# EAGLE schematic PLD Controller Board (EAGLE 9.6.2)
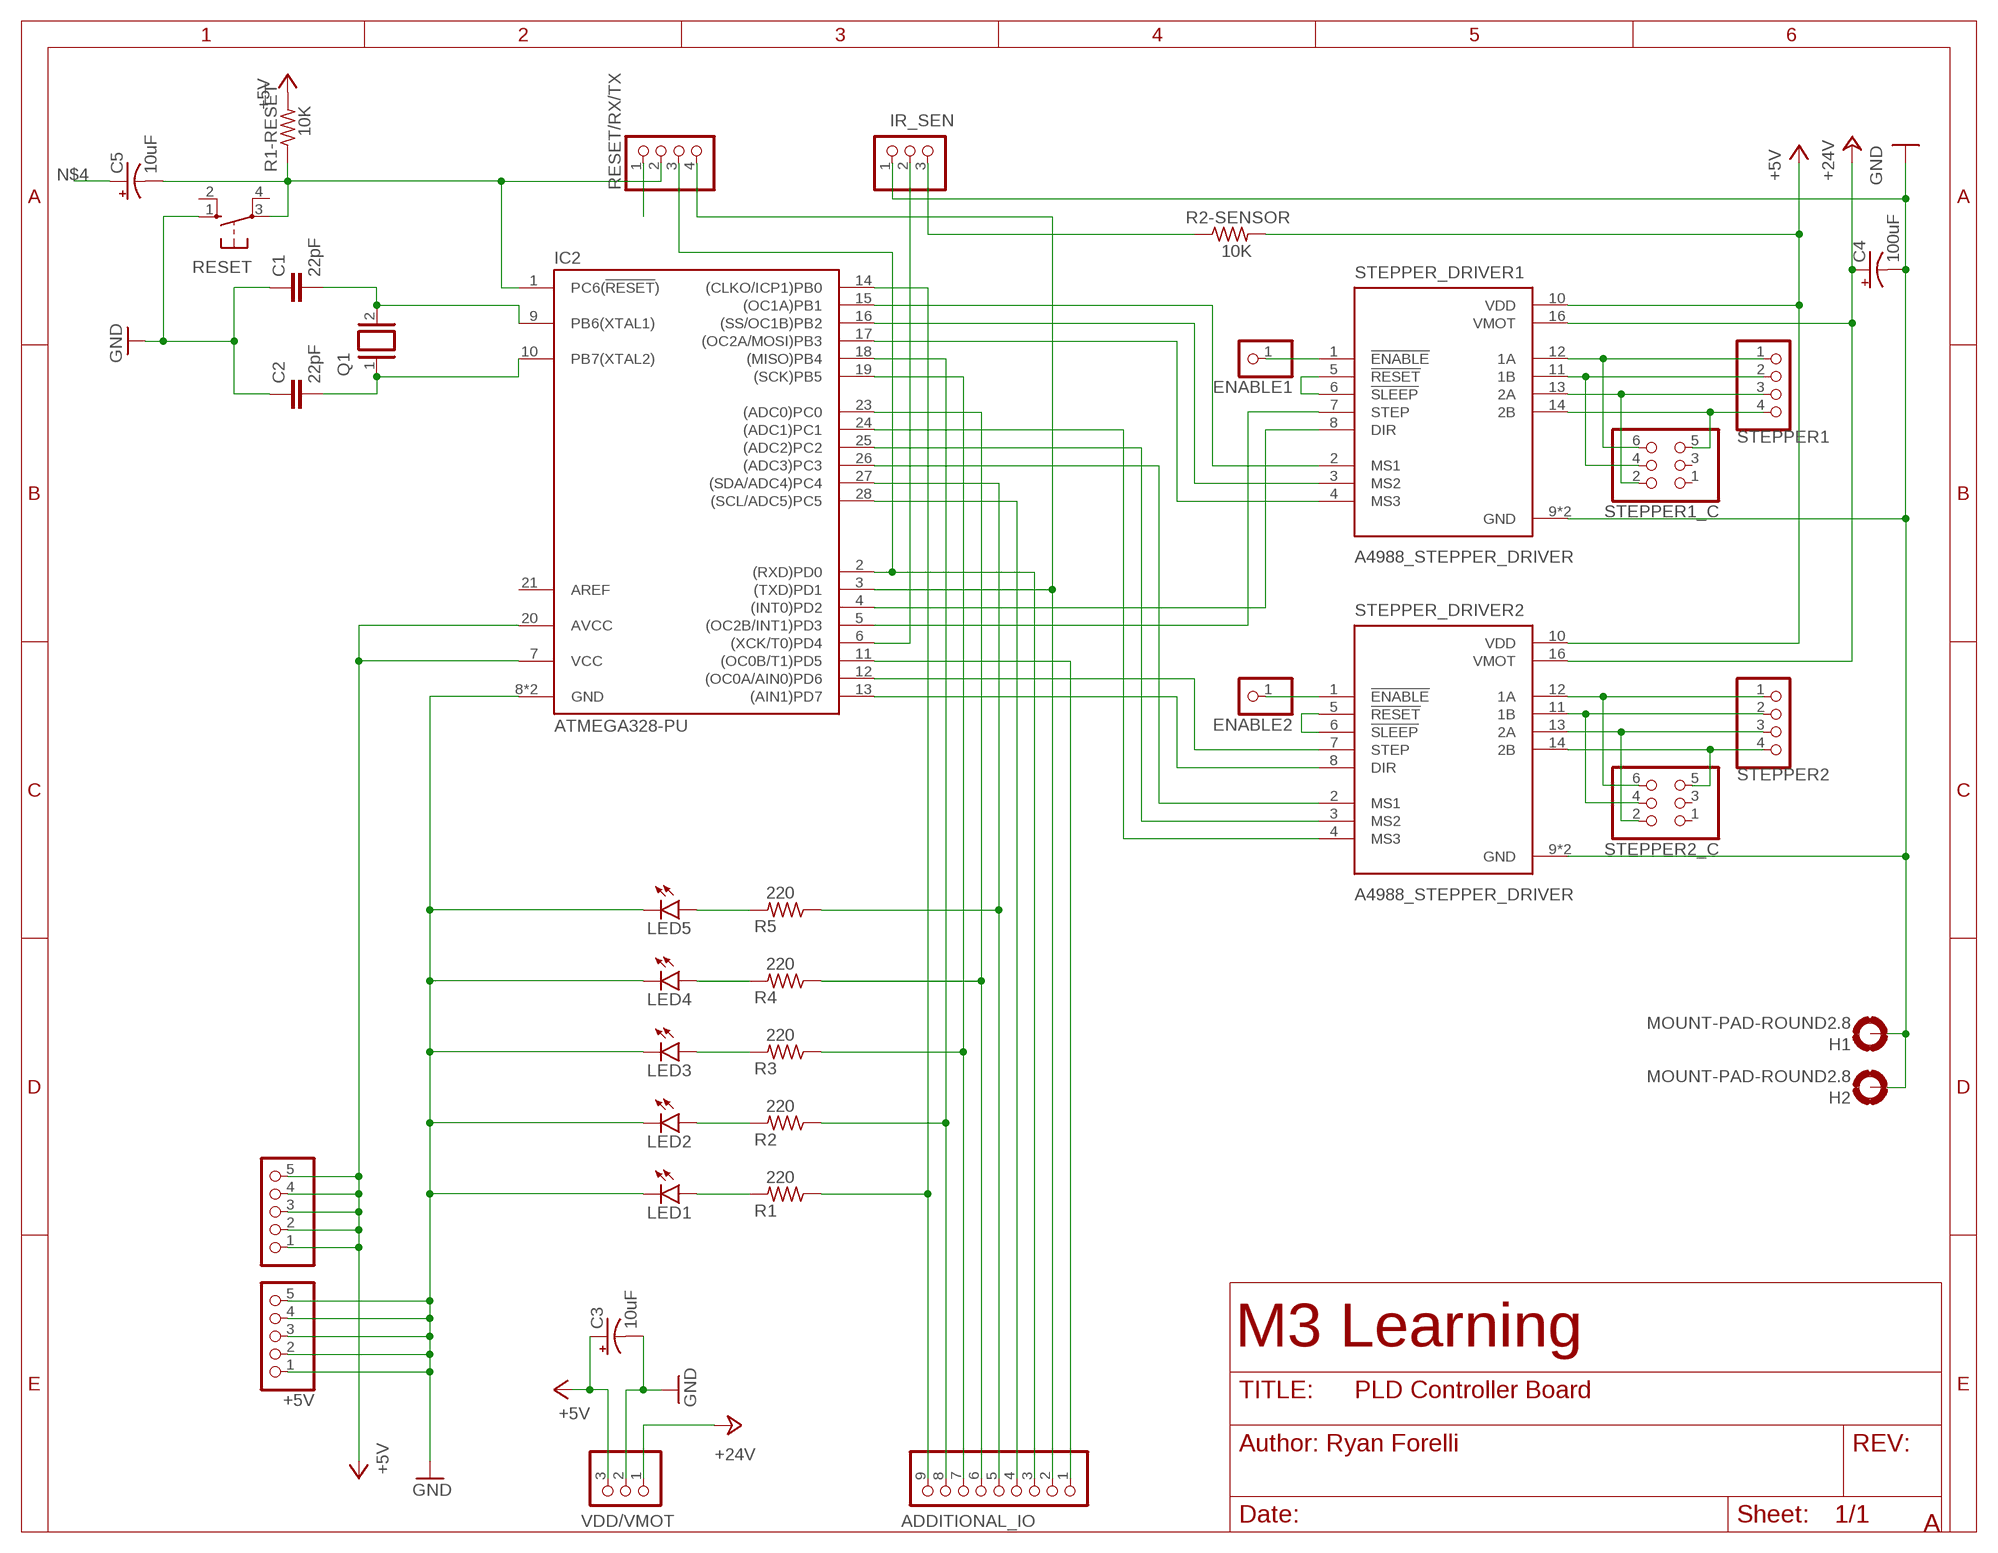
[diagram p0: schematic, sheet 1]

## Parts
+5V  PINHD-1X5  [1X05]
ADDITIONAL_IO  PINHD-1X9  [1X09]
C1  22pF  22PF-PTH-2.54MM-200V-5%  [CAP-PTH-2.54]
C2  22pF  22PF-PTH-2.54MM-200V-5%  [CAP-PTH-2.54]
C3  10uF  10UF-POLAR-RADIAL-2.5MM-25V-20%  [CPOL-RADIAL-2.5MM-5MM]
C4  100uF  10UF-POLAR-RADIAL-2.5MM-25V-20%  [CPOL-RADIAL-2.5MM-5MM]
C5  10uF  10UF-POLAR-RADIAL-2.5MM-25V-20%  [CPOL-RADIAL-2.5MM-5MM]
ENABLE1  PINHD-1X1  [1X01]
ENABLE2  PINHD-1X1  [1X01]
GND  PINHD-1X5  [1X05]
H1  MOUNT-PAD-ROUND2.8  [2,8-PAD]
H2  MOUNT-PAD-ROUND2.8  [2,8-PAD]
IC2  ATMEGA328-PU  [DIL28]
IR_SEN  PINHD-1X3  [1X03]
LED1  LED5MM  [LED5MM]
LED2  LED5MM  [LED5MM]
LED3  LED5MM  [LED5MM]
LED4  LED5MM  [LED5MM]
LED5  LED5MM  [LED5MM]
Q1  XTAL/S  [QS]
R1  220  R-US_0204/7  [0204/7]
R1-RESET  10K  R-US_0204/7  [0204/7]
R2  220  R-US_0204/7  [0204/7]
R2-SENSOR  10K  R-US_0204/7  [0204/7]
R3  220  R-US_0204/7  [0204/7]
R4  220  R-US_0204/7  [0204/7]
R5  220  R-US_0204/7  [0204/7]
RESET  10-XX  [B3F-10XX]
RESET/RX/TX  PINHD-1X4  [1X04]
STEPPER1  PINHD-1X4  [1X04]
STEPPER1_C  PINHD-2X3  [2X03]
STEPPER2  PINHD-1X4  [1X04]
STEPPER2_C  PINHD-2X3  [2X03]
STEPPER_DRIVER1  A4988_STEPPER_DRIVER  A4988_STEPPER_MOTOR_DRIVER_CARRIER  [MODULE_A4988_STEPPER_MOTOR_DRIVER_CARRIER]
STEPPER_DRIVER2  A4988_STEPPER_DRIVER  A4988_STEPPER_MOTOR_DRIVER_CARRIER  [MODULE_A4988_STEPPER_MOTOR_DRIVER_CARRIER]
VDD/VMOT  PINHD-1X3  [1X03]

## Nets
+5V: C3.1(+) GND.1 GND.2 GND.3 GND.4 GND.5 IC2.7(VCC) IC2.20(AVCC) R1-RESET.2 R2-SENSOR.2 STEPPER_DRIVER1.10(VDD) STEPPER_DRIVER2.10(VDD) VDD/VMOT.3
+24V: C4.1(+) STEPPER_DRIVER1.16(VMOT) STEPPER_DRIVER2.16(VMOT) VDD/VMOT.1
GND: +5V.1 +5V.2 +5V.3 +5V.4 +5V.5 C1.1 C2.1 C3.2(-) C4.2(-) H1.B2,8(MOUNT) H2.B2,8(MOUNT) IC2.8(GND) IC2.22(GND) IR_SEN.1 LED1.K(C) LED2.K(C) LED3.K(C) LED4.K(C) LED5.K(C) RESET.1(S) STEPPER_DRIVER1.9(GND) STEPPER_DRIVER1.15(GND) STEPPER_DRIVER2.9(GND) STEPPER_DRIVER2.15(GND) VDD/VMOT.2
N$1: C5.2(-) IC2.1(PC6(!RESET!)) R1-RESET.1 RESET.3(P) RESET/RX/TX.2
N$2: C1.2 IC2.9(PB6(XTAL1)) Q1.2
N$3: C2.2 IC2.10(PB7(XTAL2)) Q1.1
N$4: C5.1(+) RESET/RX/TX.1
N$5: STEPPER_DRIVER1.5(!RESET) STEPPER_DRIVER1.6(!SLEEP)
N$6: STEPPER_DRIVER2.5(!RESET) STEPPER_DRIVER2.6(!SLEEP)
N$7: IR_SEN.3 R2-SENSOR.1
N$8: STEPPER1.2 STEPPER1_C.4 STEPPER_DRIVER1.11(1B)
N$9: STEPPER1.3 STEPPER1_C.2 STEPPER_DRIVER1.13(2A)
N$10: STEPPER1.4 STEPPER1_C.5 STEPPER_DRIVER1.14(2B)
N$11: STEPPER2.1 STEPPER2_C.6 STEPPER_DRIVER2.12(1A)
N$12: STEPPER2.2 STEPPER2_C.4 STEPPER_DRIVER2.11(1B)
N$13: STEPPER2.3 STEPPER2_C.2 STEPPER_DRIVER2.13(2A)
N$14: STEPPER2.4 STEPPER2_C.5 STEPPER_DRIVER2.14(2B)
N$15: ENABLE1.1 STEPPER_DRIVER1.1(!ENABLE)
N$16: ENABLE2.1 STEPPER_DRIVER2.1(!ENABLE)
N$17: LED4.A R4.2
N$18: LED3.A R3.2
N$19: LED2.A R2.2
N$20: LED1.A R1.2
N$21: IC2.4((INT0)PD2) STEPPER_DRIVER1.8(DIR)
N$22: IC2.5((OC2B/INT1)PD3) STEPPER_DRIVER1.7(STEP)
N$23: IC2.13((AIN1)PD7) STEPPER_DRIVER2.8(DIR)
N$24: IC2.12((OC0A/AIN0)PD6) STEPPER_DRIVER2.7(STEP)
N$25: IC2.15((OC1A)PB1) STEPPER_DRIVER1.2(MS1)
N$26: IC2.16((SS/OC1B)PB2) STEPPER_DRIVER1.3(MS2)
N$27: IC2.17((OC2A/MOSI)PB3) STEPPER_DRIVER1.4(MS3)
N$28: IC2.26((ADC3)PC3) STEPPER_DRIVER2.2(MS1)
N$29: IC2.25((ADC2)PC2) STEPPER_DRIVER2.3(MS2)
N$30: IC2.24((ADC1)PC1) STEPPER_DRIVER2.4(MS3)
N$31: IC2.6((XCK/T0)PD4) IR_SEN.2
N$32: ADDITIONAL_IO.9 IC2.14((CLKO/ICP1)PB0) R1.1
N$33: ADDITIONAL_IO.8 IC2.18((MISO)PB4) R2.1
N$34: ADDITIONAL_IO.7 IC2.19((SCK)PB5) R3.1
N$35: ADDITIONAL_IO.6 IC2.23((ADC0)PC0) R4.1
N$36: ADDITIONAL_IO.5 IC2.27((SDA/ADC4)PC4) R5.1
N$37: ADDITIONAL_IO.4 IC2.28((SCL/ADC5)PC5)
N$38: ADDITIONAL_IO.3 IC2.2((RXD)PD0) RESET/RX/TX.3
N$39: ADDITIONAL_IO.2 IC2.3((TXD)PD1) RESET/RX/TX.4
N$40: ADDITIONAL_IO.1 IC2.11((OC0B/T1)PD5)
N$41: LED5.A R5.2
N$42: STEPPER1.1 STEPPER1_C.6 STEPPER_DRIVER1.12(1A)
Unconnected: IC2.21(AREF) RESET.2(S1) RESET.4(P1) STEPPER1_C.1 STEPPER1_C.3 STEPPER2_C.1 STEPPER2_C.3

## Notes on the sheet
- M3 Learning
- A

## Library data of the parts
+5V GND = pinhead:PINHD-1X5: PIN HEADER
ADDITIONAL_IO = pinhead:PINHD-1X9: PIN HEADER
C1 C2 = SparkFun-Capacitors:22PF: 22pF ceramic capacitors A capacitor is a passive two-terminal electrical component used to store electrical energy temporarily in an electric field.; PROD_ID: CAP-09128
C3 C5 = SparkFun-Capacitors:10UF-POLAR: 10.0µF polarized capacitors A capacitor is a passive two-terminal electrical component used to store electrical energy temporarily in an electric field.; PROD_ID: CAP-08440
C4 = SparkFun-Capacitors:10UF-POLAR: 10.0µF polarized capacitors A capacitor is a passive two-terminal electrical component used to store electrical energy temporarily in an electric field.; PROD_ID: CAP-08440; VALUE: 10uF
ENABLE1 ENABLE2 = pinhead:PINHD-1X1: PIN HEADER
H1 H2 = holes:MOUNT-PAD-ROUND: MOUNTING PAD, round
IC2 = ATMEGA328-PU:ATMEGA328-PU: Atmel ATmega48/88/168/328 AVR Microcontroller; AVAILABILITY: Unavailable; DESCRIPTION: AVR AVR® ATmega Microcontroller IC 8-Bit 20MHz 32KB _16K x 16_ FLASH 28-PDIP; MF: Microchip Technology; MP: ATMEGA328-PU; PACKAGE: DIP-28 Microchip Technology; PRICE: None
IR_SEN VDD/VMOT = pinhead:PINHD-1X3: PIN HEADER
LED1-LED5 = led:LED: LED OSRAM: - CHIPLED LG R971, LG N971, LY N971, LG Q971, LY Q971, LO R971, LY R971 LH N974, LH R974 LS Q976, LO Q976, LY Q976 LO Q996 - Hyper CHIPLED LW Q18S LB Q993, LB Q99A, LB R99A - SideLED LS A670, LO A670, LY A670, LG A670, LP A670 LB A673, LV A673, LT A673, LW A673 LH A674 LY A675 LS A676, LA A676, LO A676, LY A676, LW A676 LS A679, LY A679, LG A679 - Hyper Micro SIDELED® LS Y876, LA Y876, LO Y876, LY Y876 LT Y87S - SmartLED LW L88C, LW L88S LB L89C, LB L89S, LG L890 LS L89K, LO L89K, LY L89K LS L896, LA L896, LO L896, LY L896 - TOPLED LS T670, LO T670, LY T670, LG T670, LP T670 LSG T670, LSP T670, LSY T670, LOP T670, LYG T670 LG T671, LOG T671, LSG T671 LB T673, LV T673, LT T673, LW T673 LH T674 LS T676, LA T676, LO T676, LY T676, LB T676, LH T676, LSB T676, LW T676 LB T67C, LV T67C, LT T67C, LS T67K, LO T67K, LY T67K, LW E67C LS E67B, LA E67B, LO E67B, LY E67B, LB E67C, LV E67C, LT E67C LW T67C LS T679, LY T679, LG T679 LS T770, LO T770, LY T770, LG T770, LP T770 LB T773, LV T773, LT T773, LW T773 LH T774 LS E675, LA E675, LY E675, LS T675 LS T776, LA T776, LO T776, LY T776, LB T776 LHGB T686 LT T68C, LB T68C - Hyper Mini TOPLED® LB M676 - Mini TOPLED Santana® LG M470 LS M47K, LO M47K, LY M47K Source: http://www.osram.convergy.de LUXEON: - LUMILED® LXK2-PW12-R00, LXK2-PW12-S00, LXK2-PW14-U00, LXK2-PW14-V00 LXK2-PM12-R00, LXK2-PM12-S00, LXK2-PM14-U00 LXK2-PE12-Q00, LXK2-PE12-R00, LXK2-PE12-S00, LXK2-PE14-T00, LXK2-PE14-U00 LXK2-PB12-K00, LXK2-PB12-L00, LXK2-PB12-M00, LXK2-PB14-N00, LXK2-PB14-P00, LXK2-PB14-Q00 LXK2-PR12-L00, LXK2-PR12-M00, LXK2-PR14-Q00, LXK2-PR14-R00 LXK2-PD12-Q00, LXK2-PD12-R00, LXK2-PD12-S00 LXK2-PH12-R00, LXK2-PH12-S00 LXK2-PL12-P00, LXK2-PL12-Q00, LXK2-PL12-R00 Source: www.luxeon.com KINGBRIGHT: KA-3528ASYC Source: www.kingbright.com
Q1 = special:XTAL/S: CRYSTAL
R1 R1-RESET R2 R2-SENSOR R3-R5 = rcl:R-US_: RESISTOR, American symbol; SPICEPREFIX: R
RESET = switch-omron:10-XX: OMRON SWITCH; MPN: B3F-1000; OC_FARNELL: 176432; OC_NEWARK: 36M3542
RESET/RX/TX STEPPER1 STEPPER2 = pinhead:PINHD-1X4: PIN HEADER
STEPPER1_C STEPPER2_C = pinhead:PINHD-2X3: PIN HEADER
STEPPER_DRIVER1 STEPPER_DRIVER2 = A4988_STEPPER_MOTOR_DRIVER_CARRIER:A4988_STEPPER_MOTOR_DRIVER_CARRIER: Stepper motor controler; IC: A4988; 1A; Uin mot: 8÷35V; AVAILABILITY: Unavailable; DESCRIPTION: Stepper Motor Driver; MF: Pololu; MP: A4988 STEPPER MOTOR DRIVER CARRIER; PACKAGE: None; PRICE: None